# EAGLE design Super_Boost (EAGLE 6.3)
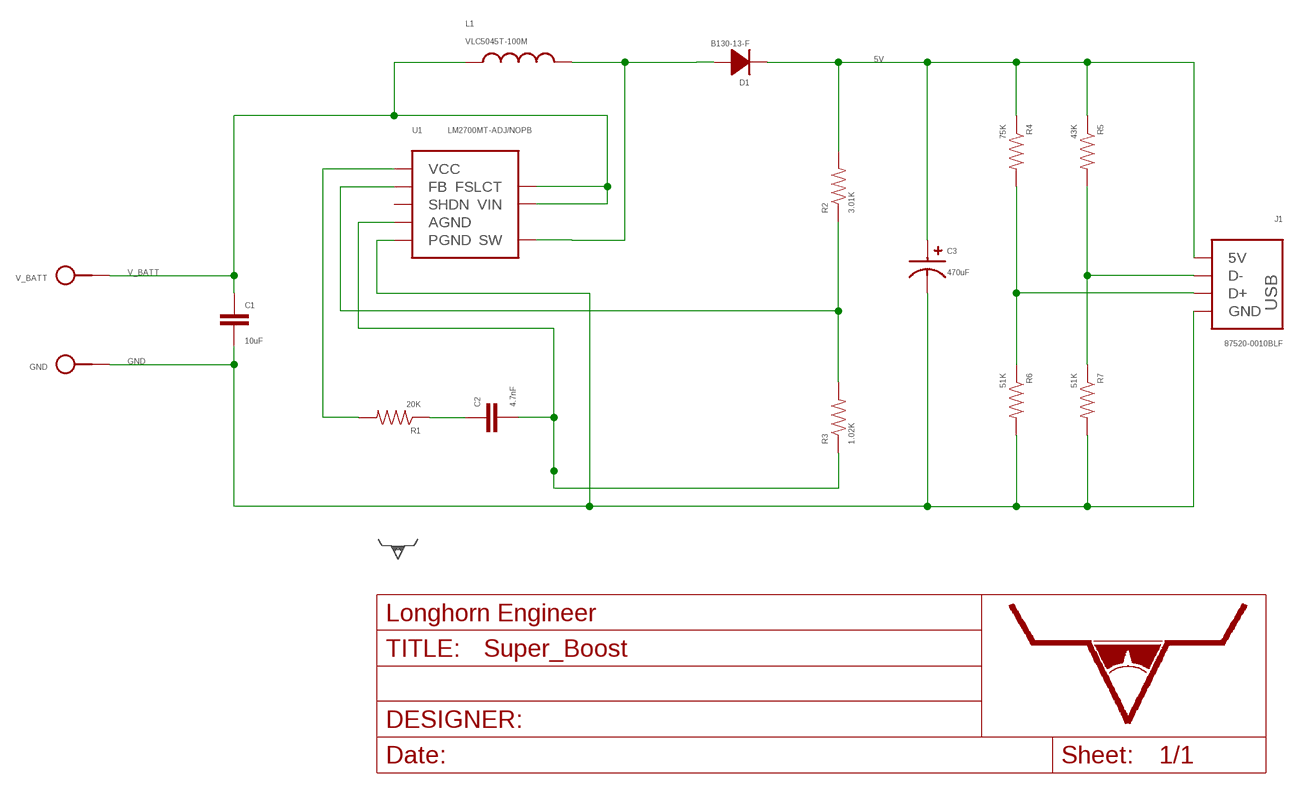
[diagram p0: schematic, sheet 1]

## Parts
C1  10uF  CAPACITOR_NON_POLAR0603  [0603]
C2  4.7nF  CAPACITOR_NON_POLAR0805  [0805]
C3  470uF  CAPACITOR_POLARIZED10MM_SMD  [10MM_CAP_SMD]
D1  B130-13-F  DIODEB130-13-F  [B130-13-F]
GND  TEST_POINT_SINGLEKEYSTONE_5115-5119  [KEYSTONE_5115-5119]
J1  87520-0010BLF  USB_487520-0010BLF  [87520-0010BLF]
L1  VLC5045T-100M  INDUCTORVLC5045  [VLC5045]
R1  20K  RESISTOR0603  [0603]
R2  3.01K  RESISTOR0603  [0603]
R3  1.02K  RESISTOR0603  [0603]
R4  75K  RESISTOR0603  [0603]
R5  43K  RESISTOR0603  [0603]
R6  51K  RESISTOR0603  [0603]
R7  51K  RESISTOR0603  [0603]
U1  LM2700MT-ADJ/NOPB  LM2700TSSOP-14  [TSSOP-14]
U$1  LHE_LOGO  [LHE_LOGO]
U$5  LHE_FRAME  [LHE_FRAME]
V_BATT  TEST_POINT_SINGLEKEYSTONE_5115-5119  [KEYSTONE_5115-5119]

## Nets
5V: C3.POS D1.CATHODE J1.5V R2.2 R4.1 R5.1
AGND: C2.2 R3.1 U1.4(AGND)
FB: R2.1 R3.2 U1.2(FB)
GND: C1.2 C3.NEG GND.P$1 J1.GND J1.SHLD0(GND) J1.SHLD1(GND) R6.2 R7.2 U1.5(PGND) U1.6(PGND) U1.7(PGND)
N$2: C2.1 R1.1
N$5: J1.D+ R4.2 R6.1
N$6: J1.D- R5.2 R7.1
SW: D1.ANODE L1.P$2 U1.8(SW) U1.9(SW) U1.10(SW)
V_BATT: C1.1 L1.P$1 U1.12(VIN) U1.13(FSLCT) V_BATT.P$1
VC: R1.2 U1.1(VCC)
Unconnected: U1.3(SHDN)

## Library data of the parts
C1 C2 = PP_Passives:CAPACITOR_NON_POLAR: Capacitor Non Polarized
C3 = PP_Passives:CAPACITOR_POLARIZED: Polarized capacitors
D1 = PP_Passives:DIODE: Diode - Single
GND V_BATT = PP_Connectors:TEST_POINT_SINGLE
J1 = PP_Connectors:USB_4
L1 = PP_Passives:INDUCTOR: Inductors
R1-R7 = PP_Passives:RESISTOR: Resistors
U1 = PP_PowerIC:LM2700
U$1 = Parker:LHE_LOGO
U$5 = PP_Aesthetics:LHE_FRAME; DNAME: Parker Dillmann; REVNUM: REV 2

## Board
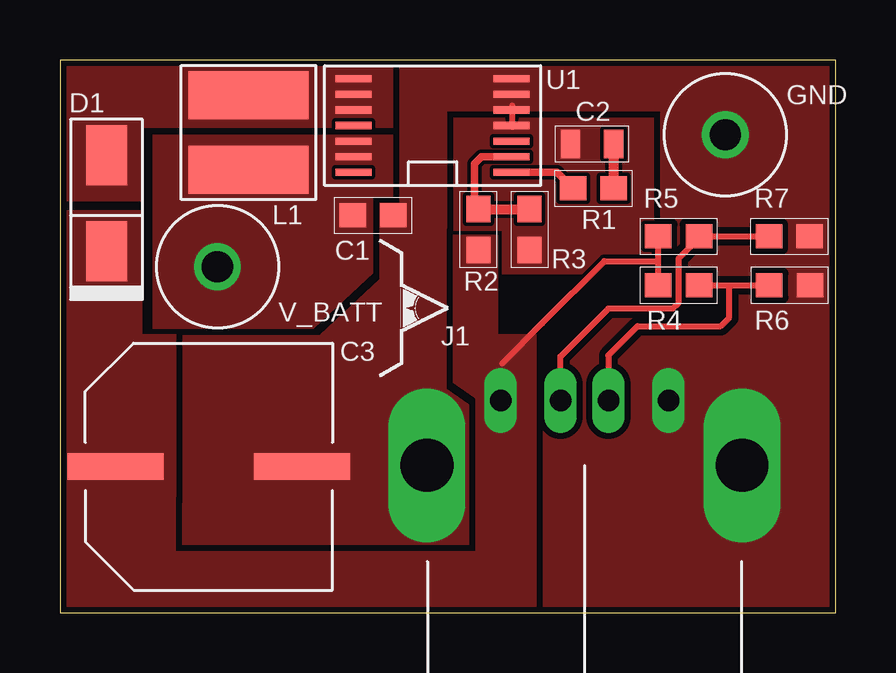
[diagram p1: board, top side]
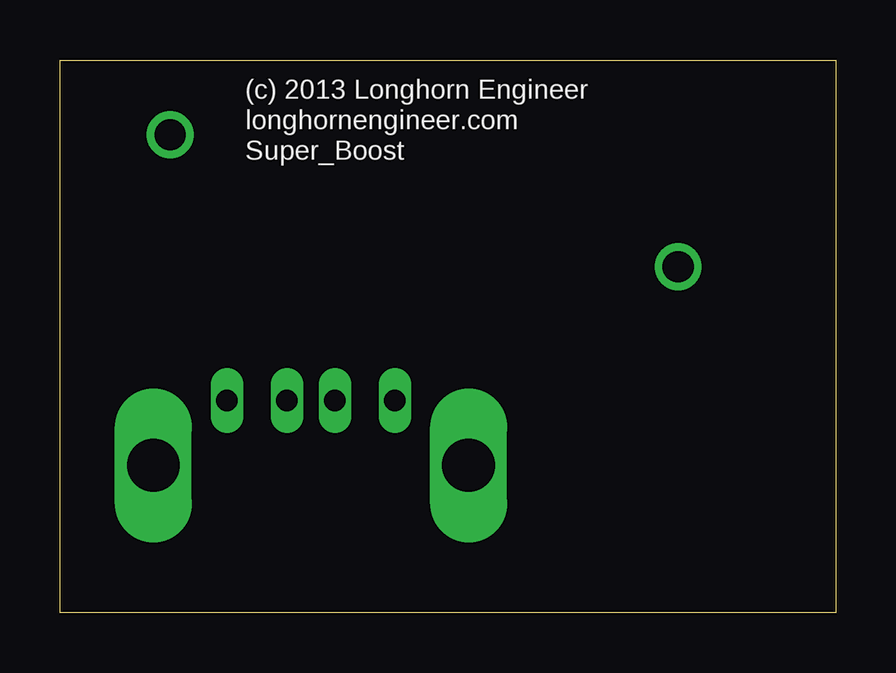
[diagram p2: board, bottom side, seen from below]

Size 32.33 x 23.03 mm. Coordinates in mm from the lower left corner, seen from the top.
Outline: 0,0 32.33,0 32.33,23.02 0,23.02 0,0
Copper layers (1*16): Top 0.035mm / dielectric 0.2mm / Bottom 0.035mm
Design rules "Seeed_2_Layer_DRU": minimum track width 6mil, minimum drill 12mil, track to track 6mil, track to pad 6mil, pad to pad 6mil, via to via 6mil, smd to smd 0mil, copper to edge 10mil, drill to drill 10mil, minimum pad ring 6mil, minimum via ring 6mil, stop-mask expansion 2mil, vias tented up to drill 25mil, thermal gap 10mil

### Footprints (pad centres in the part's own frame; a part is rotated, then mirrored left to right if it is on the bottom)
0603 = smd 1.1 x 1: 1 -0.85,0; 2 0.85,0
0805 = smd 0.8 x 1.2: 1 -0.9,0; 2 0.9,0
10MM_CAP_SMD = smd 1.1 x 4: NEG 0,-3.88; POS 0,3.88
B130-13-F = smd 2.5 x 1.7: ANODE 2,0; CATHODE -2,0
KEYSTONE_5115-5119 = drill 1.3: P$1 0,0
87520-0010BLF = drill 0.9 long: 5V -3.5,2.71; D+ 1,2.71; D- -1,2.71; GND 3.5,2.71 | drill 2.2 long: SHLD0 -6.57,0; SHLD1 6.57,0
VLC5045 = smd 2 x 5: P$1 -1.55,0; P$2 1.55,0
TSSOP-14 = smd 1.5 x 0.3: 1 -3.3,1.95; 2 -3.3,1.3; 3 -3.3,0.65; 4 -3.3,0; 5 -3.3,-0.65; 6 -3.3,-1.3; 7 -3.3,-1.95; 8 3.3,-1.95; 9 3.3,-1.3; 10 3.3,-0.65; 11 3.3,0; 12 3.3,0.65; 13 3.3,1.3; 14 3.3,1.95

### Placement (x,y rotation side)
C1  13.05,16.55 0 top
C2  22.18,19.53 180 top
C3  6.21,6.08 90 top
D1  1.94,17.06 90 top
GND  27.74,19.91 0 top
J1  21.87,6.13 0 top
L1  7.86,20 90 top
R1  22.24,17.67 180 top
R2  17.44,15.96 270 top
R3  19.58,15.96 90 top
R4  25.79,13.64 0 top
R5  25.79,15.67 0 top
R6  30.42,13.64 0 top
R7  30.4,15.68 0 top
U1  15.53,20.29 180 top
U$1  16.26,9.6 90 top
U$5  24.61,16.33 0 bottom
V_BATT  6.57,14.41 0 top

### Tracks (layer width: path | path; a pad name or v marks a point on that pad's centre or on a via)
5V
  Top 0.254: 18.44,10.39 20.1,12.05 22.7,14.64 24.94,14.64 | R4.1 24.94,14.64 | 24.94,14.64 R5.1
  pour Top (rank 3, no thermals): 0.24,16.76 3.4,16.76 3.4,11.6 4.83,11.6 4.83,4.83 0.24,4.83
  pour Top (rank 3, no thermals): 19.86,11.57 17.32,11.57 17.32,2.54 4.83,2.54 4.83,7.81 0.27,7.81 0.27,0.27 19.86,0.27
  pour Top (rank 2, no thermals): 16.41,15.75 18.25,15.75 18.25,11.57 18.26,9.27 18.2,8.33 16.41,9.58
AGND
  Top 0.254: 18.85,20.61 18.85,20.23
  pour Top (rank 3, no thermals): 16.41,20.61 24.77,20.61 24.77,14.1 16.41,14.1
FB
  Top 0.305: U1.2 17.57,19 17.29,18.71 17.29,16.97 R2.1
  Top 0.406: R2.1 19.61,16.81 R3.2
GND
  Top 0.254: 18.85,21.12 18.85,20.61
  pour Top (isolate 0.254, rank 6, no thermals): 0.25,22.77 32.08,22.77 32.08,0.25 0.25,0.25
N$2
  Top 0.406: R1.1 23.09,19.21 C2.1
N$5
  Top 0.254: R6.1 R4.2 27.9,13.63 27.9,12.29 27.55,11.94 24.08,11.94 22.86,10.72 22.86,8.85 J1.D+
N$6
  Top 0.254: R7.1 29.25,15.67 R5.2 26.64,15.61 25.79,14.76 25.79,14.67 25.79,13.66 25.79,12.89 25.56,12.66 22.86,12.66 20.86,10.66 20.87,10.65 J1.D-
SW
  pour Top (no thermals): 13.89,22.77 13.89,20.19 3.4,20.19 3.4,17.14 0.24,17.14 0.24,22.77
V_BATT
  pour Top (rank 2, no thermals): 13.89,19.9 3.86,19.9 3.86,11.82 10.58,11.82 11.86,13.03 13.04,14.15 13.04,17.35 13.89,17.35
VC
  Top 0.305: R1.2 20.72,18.34 U1.1